# EAGLE design G021old (EAGLE 6.6.0)
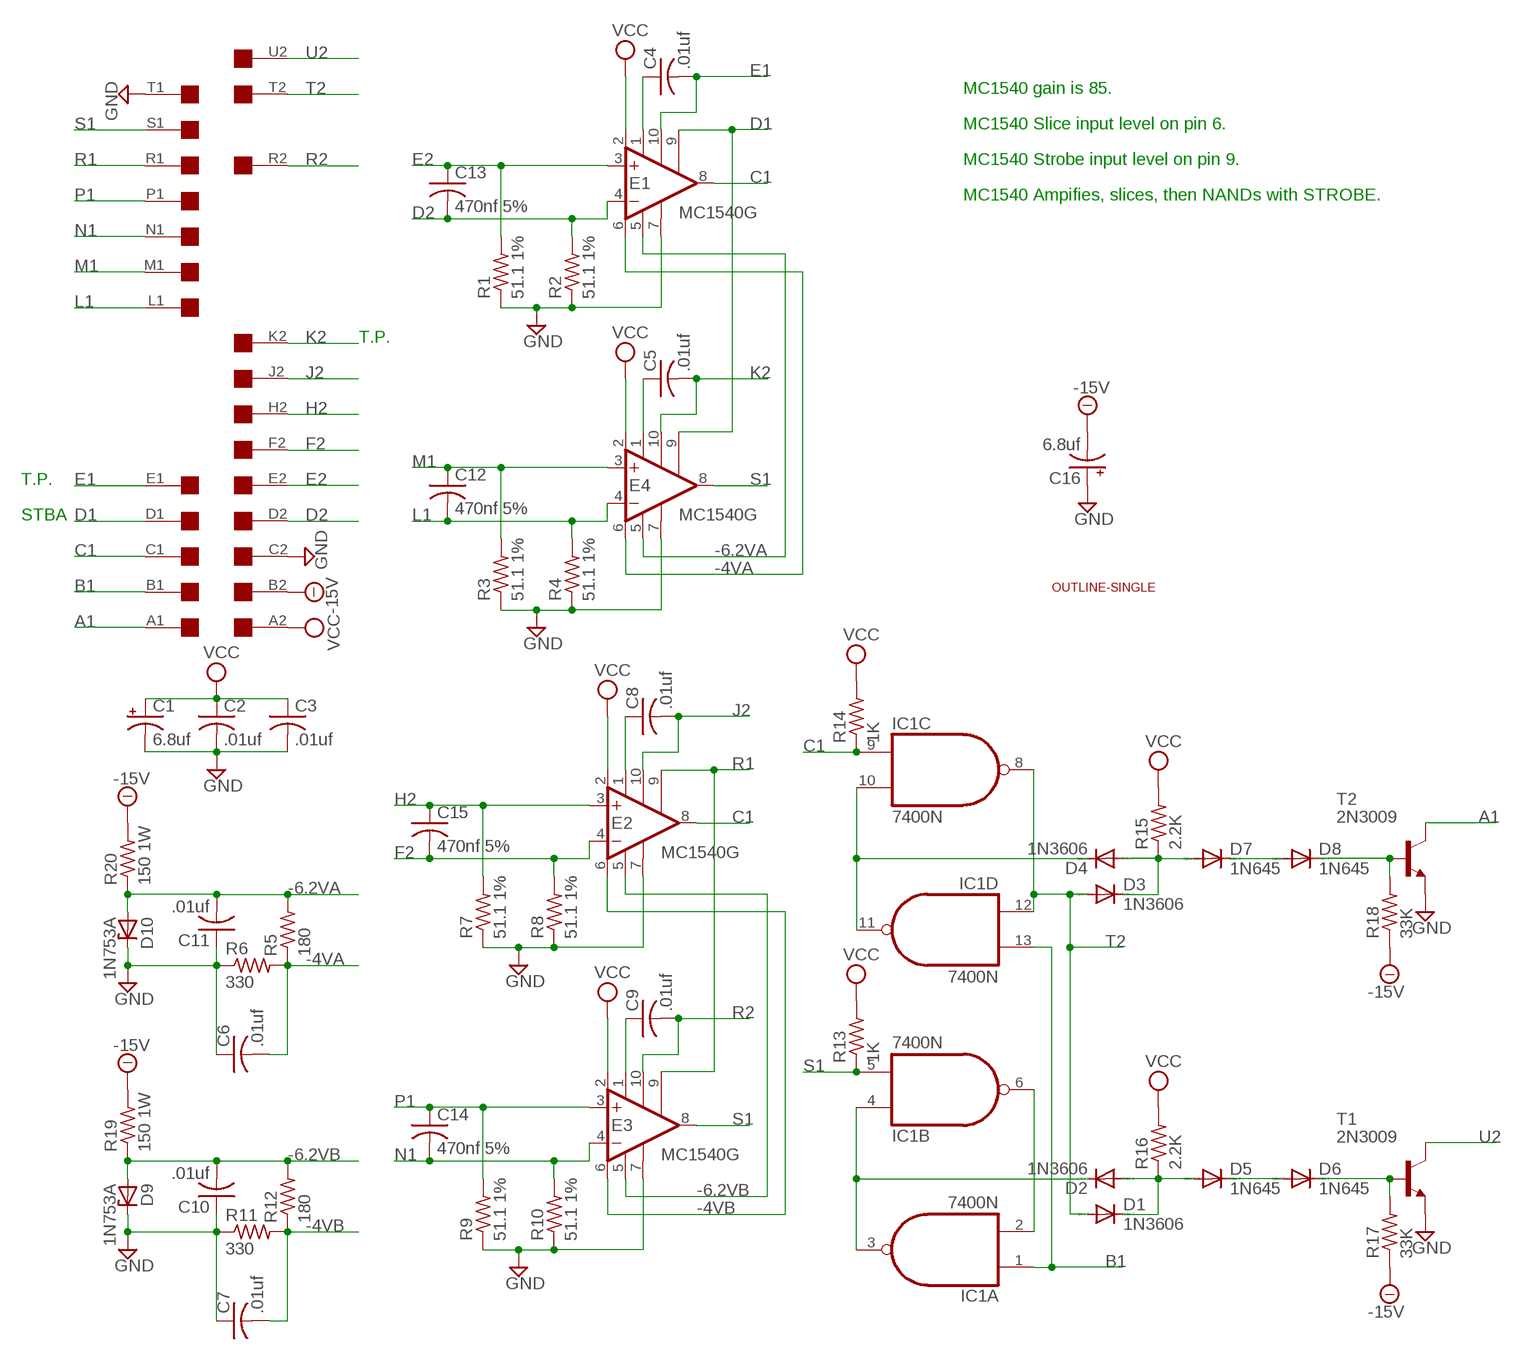
[diagram p0: schematic, sheet 1]

## Parts
C1  6.8uf  CPOL-USE15-5AXIAL  [E15-5]
C2  .01uf  C-US050-025X075  [C050-025X075]
C3  .01uf  C-US050-025X075  [C050-025X075]
C4  .01uf  C-US050-025X075  [C050-025X075]
C5  .01uf  C-US050-025X075  [C050-025X075]
C6  .01uf  C-US050-025X075  [C050-025X075]
C7  .01uf  C-US050-025X075  [C050-025X075]
C8  .01uf  C-US050-025X075  [C050-025X075]
C9  .01uf  C-US050-025X075  [C050-025X075]
C10  .01uf  C-US050-025X075  [C050-025X075]
C11  .01uf  C-US050-025X075  [C050-025X075]
C12  470nf 5%  C-US050-025X075  [C050-025X075]
C13  470nf 5%  C-US050-025X075  [C050-025X075]
C14  470nf 5%  C-US050-025X075  [C050-025X075]
C15  470nf 5%  C-US050-025X075  [C050-025X075]
C16  6.8uf  CPOL-USE15-5AXIAL  [E15-5]
D1  1N3606  1N4148DO35-10  [DO35-10]
D2  1N3606  1N4148DO35-10  [DO35-10]
D3  1N3606  1N4148DO35-10  [DO35-10]
D4  1N3606  1N4148DO35-10  [DO35-10]
D5  1N645  1N4148DO35-10  [DO35-10]
D6  1N645  1N4148DO35-10  [DO35-10]
D7  1N645  1N4148DO35-10  [DO35-10]
D8  1N645  1N4148DO35-10  [DO35-10]
D9  1N753A  ZENER-DIODEF126-10  [F126Z10]
D10  1N753A  ZENER-DIODEF126-10  [F126Z10]
E1  MC1540G  [602B]
E2  MC1540G  [602B]
E3  MC1540G  [602B]
E4  MC1540G  [602B]
IC1  7400N  [DIL14]
R1  51.1 1%  R-US_0207/10  [0207/10]
R2  51.1 1%  R-US_0207/10  [0207/10]
R3  51.1 1%  R-US_0207/10  [0207/10]
R4  51.1 1%  R-US_0207/10  [0207/10]
R5  180  R-US_0207/10  [0207/10]
R6  330  R-US_0207/10  [0207/10]
R7  51.1 1%  R-US_0207/10  [0207/10]
R8  51.1 1%  R-US_0207/10  [0207/10]
R9  51.1 1%  R-US_0207/10  [0207/10]
R10  51.1 1%  R-US_0207/10  [0207/10]
R11  330  R-US_0207/10  [0207/10]
R12  180  R-US_0207/10  [0207/10]
R13  1K  R-US_0207/10  [0207/10]
R14  1K  R-US_0207/10  [0207/10]
R15  2.2K  R-US_0207/10  [0207/10]
R16  2.2K  R-US_0207/10  [0207/10]
R17  33K  R-US_0207/10  [0207/10]
R18  33K  R-US_0207/10  [0207/10]
R19  150 1W  R-US_0414/15  [0414/15]
R20  150 1W  R-US_0414/15  [0414/15]
T1  2N3009  2N3565  [TO92]
T2  2N3009  2N3565  [TO92]
U$1  SINGLE  [EDGE-CON2]
U$2  OUTLINE-SINGLE  [SINGLE]

## Nets
-4VA: C6.2 E1.6(SLICE) E4.6(SLICE) R5.1 R6.2
-4VB: C7.2 E2.6(SLICE) E3.6(SLICE) R11.2 R12.1
-6.2VA: C11.2 D10.A E1.5(V-) E4.5(V-) R5.2 R20.1
-6.2VB: C10.2 D9.A E2.5(V-) E3.5(V-) R12.2 R19.1
-15V: C16.- R17.1 R18.1 R19.2 R20.2 U$1.B2
A1: T2.1(C) U$1.A1
B1: IC1.1(A:I0) IC1.13(D:I1) U$1.B1
C1: E1.8(OUT) E2.8(OUT) IC1.9(C:I0) R14.1 U$1.C1
D1: E1.9(ISTROBE) E4.9(ISTROBE) U$1.D1
D2: C13.2 E1.4(-IN) R2.2 U$1.D2
E1: C4.2 E1.10(CEXTB) U$1.E1
E2: C13.1 E1.3(+IN) R1.2 U$1.E2
F2: C15.2 E2.4(-IN) R8.2 U$1.F2
GND: C1.- C2.2 C3.2 C6.1 C7.1 C10.1 C11.1 C16.+ D9.C D10.C E1.7(GND) E2.7(GND) E3.7(GND) E4.7(GND) R1.1 R2.1 R3.1 R4.1 R6.1 R7.1 R8.1 R9.1 R10.1 R11.1 T1.3(E) T2.3(E) U$1.C2 U$1.T1
H2: C15.1 E2.3(+IN) R7.2 U$1.H2
J2: C8.2 E2.10(CEXTB) U$1.J2
K2: C5.2 E4.10(CEXTB) U$1.K2
L1: C12.2 E4.4(-IN) R4.2 U$1.L1
M1: C12.1 E4.3(+IN) R3.2 U$1.M1
N1: C14.2 E3.4(-IN) R10.2 U$1.N1
N$1: C4.1 E1.1(CEXTA)
N$2: C8.1 E2.1(CEXTA)
N$3: C5.1 E4.1(CEXTA)
N$4: C9.1 E3.1(CEXTA)
N$6: D1.C D2.A D5.A R16.1
N$7: D4.C IC1.10(C:I1) IC1.11(D:O)
N$8: D2.C IC1.3(A:O) IC1.4(B:I0)
N$9: IC1.2(A:I1) IC1.6(B:O)
N$10: D3.C D4.A D7.A R15.1
N$11: D7.C D8.A
N$12: D5.C D6.A
N$13: D8.C R18.2 T2.2(B)
N$14: D6.C R17.2 T1.2(B)
P1: C14.1 E3.3(+IN) R9.2 U$1.P1
R1: E2.9(ISTROBE) E3.9(ISTROBE) U$1.R1
R2: C9.2 E3.10(CEXTB) U$1.R2
S1: E3.8(OUT) E4.8(OUT) IC1.5(B:I1) R13.1 U$1.S1
T2: D1.A D3.A IC1.8(C:O) IC1.12(D:I0) U$1.T2
U2: T1.1(C) U$1.U2
VCC: C1.+ C2.1 C3.1 E1.2(V+) E2.2(V+) E3.2(V+) E4.2(V+) R13.2 R14.2 R15.2 R16.2 U$1.A2
Unconnected: U$1.F1 U$1.H1 U$1.J1 U$1.K1 U$1.L2 U$1.M2 U$1.N2 U$1.P2 U$1.S2 U$1.U1 U$1.V1 U$1.V2

## Notes on the sheet
- MC1540 gain is 85.
- MC1540 Slice input level on pin 6.
- MC1540 Strobe input level on pin 9.
- MC1540 Ampifies, slices, then NANDs with STROBE.
- T.P.
- T.P.
- STBA

## Power pins joined to a net without a drawn wire
GND: IC1.7(P:GND)
VCC: IC1.14(P:VCC)

## Library data of the parts
C1 C16 = rcl:CPOL-US: POLARIZED CAPACITOR, American symbol
C2-C15 = rcl:C-US: CAPACITOR, American symbol
D1-D8 = diode:1N4148: DIODE high speed (Philips)
D9 D10 = diode:ZENER-DIODE: Z-Diode
E1-E4 = dec-con:MC1540: OP AMP
IC1 = 74xx-us:74*00: Quad 2-input NAND gate
R1-R20 = rcl:R-US_: RESISTOR, American symbol
T1 T2 = transistor:2N3565: NPN TRANSISTOR
U$1 = dec-con:SINGLE: Single-Height DEC board
U$2 = dec-con:OUTLINE-*: Board outlines for DEC boards.

## Board
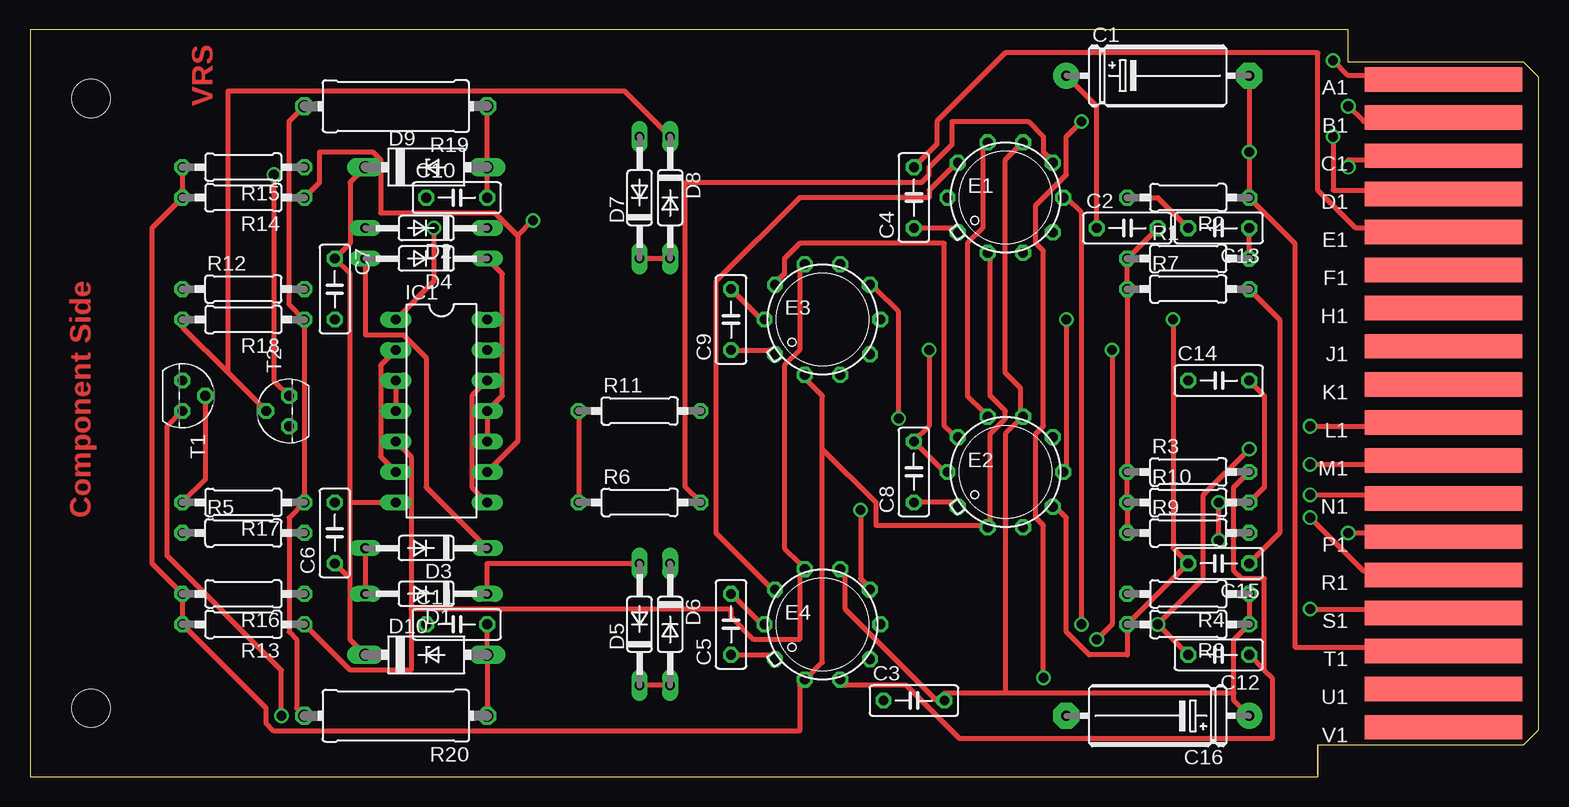
[diagram p1: board, top side]
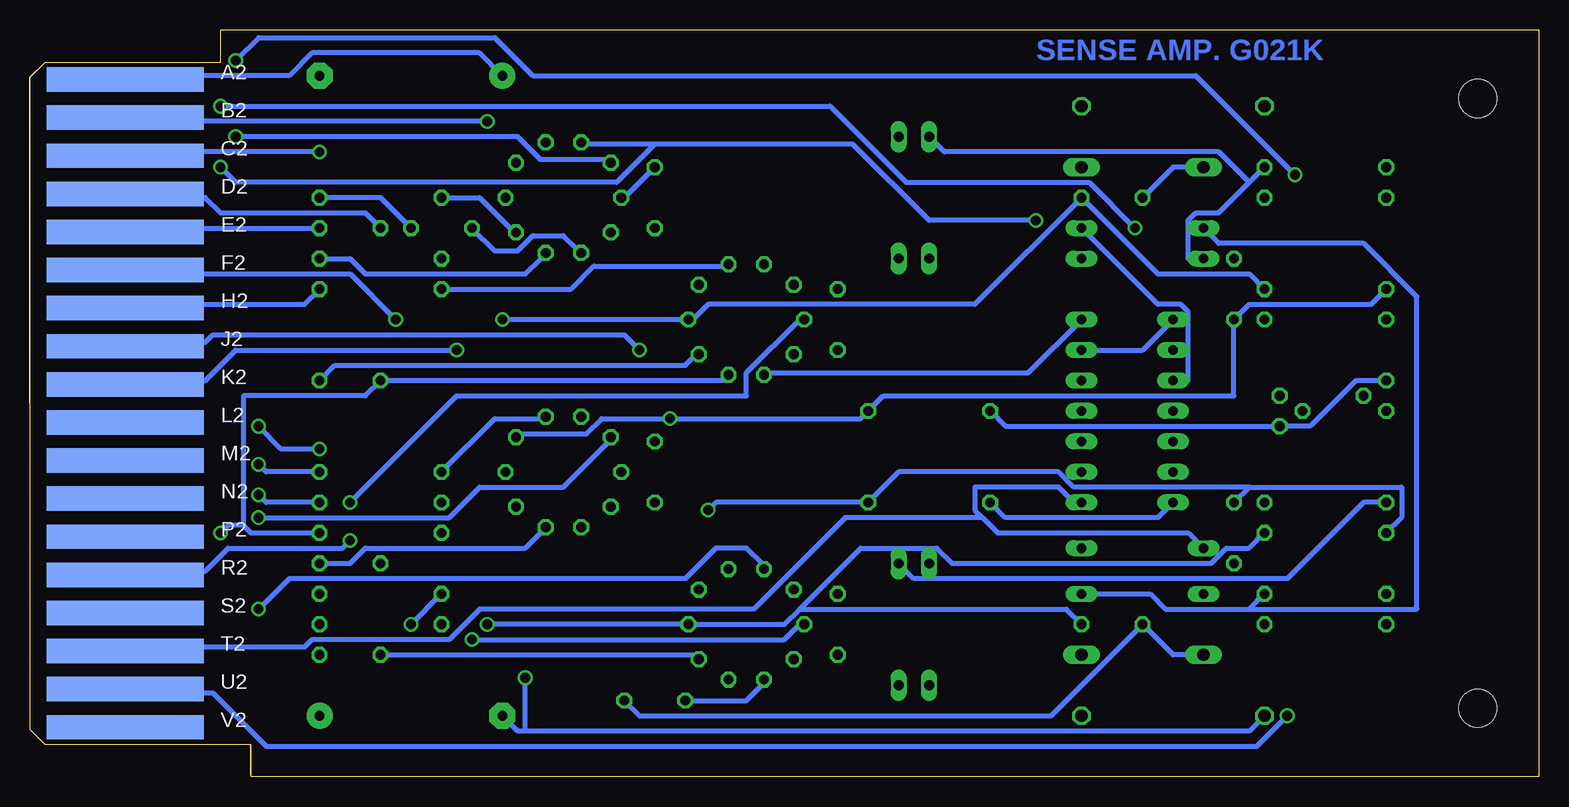
[diagram p2: board, bottom side, seen from below]

Size 125.73 x 62.23 mm. Coordinates in mm from the lower left corner, seen from the top.
Copper layers (1+16): Top 0.035mm / dielectric 1.5mm / Bottom 0.035mm
Design rules "16mils": minimum track width 16mil, minimum drill 32mil, track to track 15mil, track to pad 10mil, pad to pad 10mil, via to via 10mil, smd to smd 10mil, copper to edge 13mil, drill to drill 10mil, minimum pad ring 10mil, minimum via ring 8mil, stop-mask expansion 0mil, vias tented up to drill 0mil, thermal gap 10mil

### Footprints (pad centres in the part's own frame; a part is rotated, then mirrored left to right if it is on the bottom)
E15-5 = drill 0.813 pad 2.159: + -7.62,0 | drill 0.813 pad 2.159 octagon: - 7.62,0
C050-025X075 = drill 0.813 octagon: 1 -2.54,0; 2 2.54,0
DO35-10 = drill 0.813 long: A 5.08,0; C -5.08,0
F126Z10 = drill 1.016 long: A 5.08,0; C -5.08,0
602B = drill 0.813 octagon: 1 -3.954,-2.897; 2 -1.478,-4.605; 3 1.478,-4.605; 4 3.954,-2.897; 5 4.825,0; 6 3.954,2.897; 7 1.478,4.605; 8 -1.477,4.605; 9 -3.954,2.897; 10 -4.825,0
DIL14 = drill 0.813 long: 1 -7.62,-3.81; 2 -5.08,-3.81; 3 -2.54,-3.81; 4 0,-3.81; 5 2.54,-3.81; 6 5.08,-3.81; 7 7.62,-3.81; 8 7.62,3.81; 9 5.08,3.81; 10 2.54,3.81; 11 0,3.81; 12 -2.54,3.81; 13 -5.08,3.81; 14 -7.62,3.81
0207/10 = drill 0.813 octagon: 1 -5.08,0; 2 5.08,0
0414/15 = drill 1.016 octagon: 1 -7.62,0; 2 7.62,0
TO92 = drill 0.813 octagon: 1 1.27,0; 2 0,1.905; 3 -1.27,0
EDGE-CON2 = smd 13.106 x 2.032: A1 7.938,4.128; B1 7.938,7.303; C1 7.938,10.477; D1 7.938,13.652; E1 7.938,16.828; F1 7.938,20.003; H1 7.938,23.177; J1 7.938,26.352; K1 7.938,29.527; L1 7.938,32.703; M1 7.938,35.877; N1 7.938,39.053; P1 7.938,42.227; R1 7.938,45.403; S1 7.938,48.578; T1 7.938,51.752; U1 7.938,54.928; V1 7.938,58.102 | smd 13.106 x 2.032 bottom: A2 7.938,4.128; B2 7.938,7.303; C2 7.938,10.477; D2 7.938,13.652; E2 7.938,16.828; F2 7.938,20.003; H2 7.938,23.177; J2 7.938,26.352; K2 7.938,29.527; L2 7.938,32.703; M2 7.938,35.877; N2 7.938,39.053; P2 7.938,42.227; R2 7.938,45.403; S2 7.938,48.578; T2 7.938,51.752; U2 7.938,54.928; V2 7.938,58.102
SINGLE = hole 3.175: 120.65,56.515; 120.65,5.715

### Placement (x,y rotation side)
C1  93.98,58.42 0 top
C2  91.44,45.72 0 top
C3  73.66,6.35 0 top
C4  73.66,48.26 90 top
C5  58.42,12.7 90 top
C6  25.4,20.32 90 top
C7  25.4,40.64 270 top
C8  73.66,25.4 90 top
C9  58.42,38.1 90 top
C10  35.56,48.26 0 top
C11  35.56,12.7 0 top
C12  99.06,10.16 180 top
C13  99.06,45.72 180 top
C14  99.06,33.02 0 top
C15  99.06,17.78 180 top
C16  93.98,5.08 180 top
D1  33.02,15.24 180 top
D2  33.02,45.72 180 top
D3  33.02,19.05 180 top
D4  33.02,43.18 180 top
D5  50.8,12.7 90 top
D6  53.34,12.7 270 top
D7  50.8,48.26 90 top
D8  53.34,48.26 270 top
D9  33.02,50.8 0 top
D10  33.02,10.16 0 top
E1  81.28,48.26 0 top
E2  81.28,25.4 0 top
E3  66.04,38.1 0 top
E4  66.04,12.7 0 top
IC1  34.29,30.48 270 top
R1  96.52,43.18 0 top
R2  96.52,48.26 180 top
R3  96.52,25.4 0 top
R4  96.52,15.24 180 top
R5  17.78,20.32 0 top
R6  50.8,22.86 0 top
R7  96.52,40.64 0 top
R8  96.52,12.7 180 top
R9  96.52,20.32 0 top
R10  96.52,22.86 0 top
R11  50.8,30.48 0 top
R12  17.78,40.64 0 top
R13  17.78,12.7 180 top
R14  17.78,48.26 180 top
R15  17.78,50.8 180 top
R16  17.78,15.24 180 top
R17  17.78,22.86 180 top
R18  17.78,38.1 180 top
R19  30.48,55.88 180 top
R20  30.48,5.08 180 top
T1  12.7,31.75 270 top
T2  21.59,30.48 90 top
U$1  125.73,62.23 180 top
U$2  125.73,62.23 180 top

### Tracks (layer width: path | path; a pad name or v marks a point on that pad's centre or on a via)
-4VA  (via drill 0.81)
  Top 0.406: v69.22,22.23 69.22,16.51 69.85,15.88 E4.6 | R6.2 54.61,24.13 54.61,49.53 74.3,49.53 74.93,50.16 74.93,50.8 76.83,52.7 76.83,54.61 83.19,54.61 84.45,53.34 84.45,52.07 85.09,51.44 E1.6
  Bottom 0.406: R5.1 11.43,21.59 11.43,24.13 24.13,24.13 | C6.2 24.13,24.13 | 24.13,24.13 38.73,24.13 40.01,25.4 53.34,25.4 R6.2 68.58,22.86 v69.22,22.23
-4VB  (via drill 0.81)
  Top 0.406: v72.39,29.84 72.39,38.73 70.48,40.64 E3.6
  Bottom 0.406: R12.1 13.97,39.37 24.13,39.37 C7.2 25.4,31.75 54.61,31.75 R11.2 56.52,29.84 v72.39,29.84 78.11,29.84 79.38,28.57 85.09,28.57 E2.6
-6.2VA  (via drill 0.81)
  Top 0.406: C11.2 D10.A R20.1 | v87.63,12.7 87.63,46.99 86.36,48.26 E1.5
  Bottom 0.406: R5.2 24.13,19.05 26.04,19.05 27.3,17.78 48.9,17.78 50.16,19.05 56.52,19.05 61.59,13.97 | 61.59,13.97 62.87,12.7 E4.5 v87.63,12.7 | C11.2 39.37,13.97 61.59,13.97
-6.2VB  (via drill 0.81)
  Top 0.406: v86.36,38.1 86.36,25.4 E2.5 | C10.2 D9.A R19.1
  Bottom 0.406: R12.2 24.13,41.91 31.75,41.91 C10.2 46.99,39.37 69.22,39.37 70.48,38.1 E3.5 v86.36,38.1
-15V  (via drill 0.81)
  Top 0.406: R20.2 22.23,5.71 22.23,11.43 21.59,12.06 21.59,21.59 R17.1 R18.1 21.59,39.37 21.59,54.61 R19.2 | v87.63,54.61 86.36,53.34 86.36,50.16 83.82,47.62 83.82,44.45 84.45,43.81 84.45,29.21 83.82,28.57 83.82,21.59 84.45,20.95 v84.45,8.26
  Bottom 0.406: C16.- 85.09,3.81 84.45,3.81 | 84.45,3.81 24.13,3.81 R20.2 | v87.63,54.61 117.47,54.61 U$1.B2 | 84.45,3.81 v84.45,8.26
A1  (via drill 0.81)
  Top 0.406: T2.1 20.32,33.02 v20.32,50.16 | v108.58,59.69 109.86,58.42 117.47,58.42 U$1.A1
  Bottom 0.406: v20.32,50.16 28.57,58.42 83.82,58.42 87,61.59 106.68,61.59 v108.58,59.69
B1  (via drill 0.81)
  Top 0.406: IC1.1 33.66,41.27 v33.66,45.72 | v109.86,55.88 111.12,54.61 117.47,54.61 U$1.B1
  Bottom 0.406: IC1.1 33.02,35.56 IC1.13 | v33.66,45.72 37.47,49.53 52.7,49.53 59.05,55.88 v109.86,55.88
C1  (via drill 0.81)
  Top 0.406: E2.8 79.38,30.48 78.11,31.75 78.11,44.45 79.38,45.72 79.38,52.7 E1.8 | IC1.9 40.64,27.94 40.64,45.09 | 40.64,45.09 38.73,46.99 29.21,46.99 29.21,51.44 28.57,52.07 24.13,52.07 24.13,49.53 R14.1 | 40.64,45.09 v41.91,46.35 | v109.86,50.8 109.86,51.44 117.47,51.44 U$1.C1
  Bottom 0.406: 73.66,52.7 57.15,52.7 50.8,46.35 v41.91,46.35 | 73.66,52.7 79.38,52.7 E1.8 | v109.86,50.8 108.58,49.53 76.83,49.53 73.66,52.7
D1  (via drill 0.81)
  Top 0.406: E4.9 61.59,15.88 57.15,20.32 57.15,41.27 64.14,48.26 74.93,48.26 74.93,48.9 76.83,50.8 E1.9 | v108.58,53.34 108.58,48.9 117.47,48.9 U$1.D1
  Bottom 0.406: v108.58,53.34 85.09,53.34 83.19,51.44 77.47,51.44 E1.9
D2
  Top 0.406: C13.2 93.98,48.26 R2.2
  Bottom 0.406: R2.2 88.27,48.26 85.72,45.72 E1.4 | C13.2 97.79,46.99 109.86,46.99 111.12,48.26 117.47,48.26 U$1.D2
E1
  Top 0.406: C4.2 75.56,52.7 75.56,54.61 81.28,60.33 107.31,60.33 107.31,48.9 110.49,45.72 117.47,45.72 U$1.E1
  Bottom 0.406: C4.2 76.2,48.26 E1.10
E2
  Top 0.406: R1.2 C13.1
  Bottom 0.406: R1.2 99.06,43.18 97.79,41.91 84.45,41.91 83.19,43.18 E1.3 | C13.1 117.47,45.72 U$1.E2
F2  (via drill 0.81)
  Top 0.406: E2.4 85.72,22.23 86.36,21.59 86.36,12.06 88.27,10.16 91.44,10.16 R8.2 C15.2 95.25,19.05 v95.25,38.1
  Bottom 0.406: v95.25,38.1 99.06,41.91 117.47,41.91 U$1.F2
GND  (via drill 0.81)
  Top 0.406: D9.C 26.67,49.53 26.67,44.45 C7.1 26.67,41.91 26.67,22.86 | R11.1 R6.1 | 26.67,16.51 C6.1 | 26.67,16.51 26.67,11.43 D10.C | 26.67,22.86 IC1.7 | 26.67,16.51 26.67,22.86 | R4.1 R8.1 100.33,11.43 100.33,6.99 | 100.33,6.99 100.33,6.35 C16.+ | E4.7 67.94,17.14 67.94,13.97 75.56,6.35 C3.2 76.2,6.99 81.28,6.99 | 81.28,6.99 100.33,6.99 | R9.1 R10.1 R3.1 R7.1 R1.1 C2.2 | E1.7 82.55,52.7 81.28,51.44 81.28,33.66 82.55,32.38 82.55,30.48 E2.7 82.55,29.84 81.28,28.57 81.28,6.99 | C1.- v101.6,52.07 R2.1 105.41,44.45 105.41,10.79 117.47,10.79 U$1.T1
  Bottom 0.406: C10.1 30.48,50.8 D9.C | T1.3 15.24,33.02 19.05,29.21 T2.3 44.45,29.21 R11.1 | D10.C 30.48,10.16 C11.1 40.64,5.08 74.93,5.08 C3.2 | R6.1 44.45,21.59 31.75,21.59 IC1.7 | R3.1 87,29.84 83.19,29.84 E2.7 | R7.1 80.64,40.64 78.74,42.55 67.94,42.55 E3.7 | R2.1 96.52,48.26 C2.2 | v101.6,52.07 117.47,52.07 U$1.C2
H2
  Top 0.406: C15.1 104.14,20.32 104.14,38.1 R7.2
  Bottom 0.406: C15.1 99.06,17.78 97.79,19.05 84.45,19.05 83.19,20.32 E2.3 | R7.2 102.87,39.37 117.47,39.37 U$1.H2
J2  (via drill 0.81)
  Top 0.406: E2.10 76.2,25.4 C8.2 74.93,29.21 v74.93,35.56
  Bottom 0.406: v74.93,35.56 76.2,36.83 110.49,36.83 111.12,36.2 117.47,36.2 U$1.J2
K2  (via drill 0.81)
  Top 0.406: C5.2 60.96,12.7 E4.10 | v88.9,11.43 90.17,12.7 v90.17,35.56
  Bottom 0.406: v88.9,11.43 62.87,11.43 61.59,12.7 E4.10 | v90.17,35.56 108.58,35.56 111.12,33.02 117.47,33.02 U$1.K2
L1  (via drill 0.81)
  Top 0.406: C12.2 v93.98,12.7 97.79,16.51 97.79,23.5 v101.6,27.3 | v106.68,29.21 117.47,29.21 U$1.L1
  Bottom 0.406: C12.2 70.48,10.16 E4.4 | v93.98,12.7 R4.2 | v106.68,29.21 104.78,27.3 v101.6,27.3
M1  (via drill 0.81)
  Top 0.406: C12.1 102.87,8.89 | 102.87,8.89 103.5,8.26 103.5,3.17 77.47,3.17 73.03,7.62 67.94,7.62 E4.3 | R3.2 100.33,24.13 100.33,17.14 100.97,16.51 102.87,16.51 102.87,8.89 | v106.68,26.04 117.47,26.04 U$1.M1
  Bottom 0.406: v106.68,26.04 106.05,25.4 R3.2
N1  (via drill 0.81)
  Top 0.406: R10.2 102.87,24.13 102.87,31.75 C14.2 | v106.68,23.5 117.47,23.5 U$1.N1
  Bottom 0.406: C14.2 100.33,34.29 71.12,34.29 70.48,34.92 E3.4 | v106.68,23.5 106.05,22.86 R10.2
N$1
  Top 0.406: C4.1 76.83,45.72 E1.1
N$2
  Top 0.406: C8.1 76.83,22.86 E2.1
N$3
  Top 0.406: C5.1 61.59,10.16 E4.1
N$4
  Top 0.406: C9.1 61.59,35.56 E3.1
N$6
  Top 0.406: D5.A 38.1,17.78 D1.C
  Bottom 0.406: 24.13,13.97 R16.1 | 24.13,13.97 31.11,13.97 32.38,15.24 D1.C | D2.A 26.67,44.45 14.61,44.45 10.16,40.01 10.16,13.97 24.13,13.97
N$7
  Top 0.406: IC1.10 IC1.11 39.37,31.75 39.37,41.91 D4.C
N$8
  Top 0.406: IC1.3 IC1.4
  Bottom 0.406: D2.C 31.75,39.37 29.84,39.37 29.21,38.73 29.21,33.02 IC1.3
N$9
  Top 0.406: IC1.6 29.21,26.67 29.21,34.29 IC1.2
N$10
  Top 0.406: D3.C 33.02,24.13 33.02,34.92 31.11,36.83 27.94,36.83 D4.A
  Bottom 0.406: 24.13,49.53 26.67,46.99 28.57,46.99 29.21,46.35 29.21,43.18 D4.A | 24.13,49.53 R15.1 | D7.A 49.53,52.07 26.67,52.07 24.13,49.53
N$11
  Top 0.406: D8.A D7.C
N$12
  Top 0.406: D6.A D5.C
N$13
  Top 0.406: 16.51,33.66 12.7,37.47 R18.2 | 16.51,33.66 T2.2 | D8.C 49.53,57.15 16.51,57.15 16.51,33.66
N$14
  Top 0.406: R17.2 14.61,24.77 T1.2
  Bottom 0.406: D6.C 52.07,16.51 20.95,16.51 14.61,22.86 R17.2
P1  (via drill 0.81)
  Top 0.406: v109.86,20.32 117.47,20.32 U$1.P1
  Bottom 0.406: E3.3 67.94,33.02 C14.1 97.79,31.75 107.95,31.75 107.95,20.95 | R9.2 107.31,20.32 107.95,20.95 | v109.86,20.32 109.22,20.95 107.95,20.95
R1  (via drill 0.81)
  Top 0.406: E3.9 62.23,41.27 62.87,41.91 62.87,43.18 64.14,44.45 76.2,44.45 76.2,29.21 76.83,28.57 E2.9 | v106.68,21.59 111.12,17.14 117.47,17.14 U$1.R1
  Bottom 0.406: v106.68,21.59 90.81,21.59 88.27,24.13 81.28,24.13 77.47,27.94 E2.9
R2  (via drill 0.81)
  Top 0.406: C9.2 60.96,38.1 E3.10 | v99.06,19.68 v99.06,22.86
  Bottom 0.406: v99.06,22.86 90.17,31.75 66.04,31.75 66.04,33.66 61.59,38.1 E3.10 | v99.06,19.68 99.69,19.05 109.22,19.05 111.12,17.14 117.47,17.14 U$1.R2
S1  (via drill 0.81)
  Top 0.406: R13.1 26.67,8.89 31.75,8.89 31.75,13.97 | 31.75,13.97 31.75,26.67 IC1.5 | E3.8 64.14,42.55 64.14,35.56 62.87,34.29 62.87,19.05 64.14,17.78 E4.8 64.14,17.14 64.14,11.43 60.33,11.43 58.42,13.34 58.42,13.97 31.75,13.97 | v106.68,13.97 117.47,13.97 U$1.S1
  Bottom 0.406: v106.68,13.97 104.14,16.51 71.12,16.51 68.58,19.05 66.04,19.05 64.77,17.78 E4.8
T2
  Top 0.406: D3.A D1.A | IC1.8 36.83,24.13 36.83,31.75 IC1.12
  Bottom 0.406: D3.A 29.21,20.32 45.09,20.32 46.35,21.59 | 46.35,21.59 46.99,22.23 46.99,24.13 40.01,24.13 38.73,22.86 IC1.8 | 46.35,21.59 57.78,21.59 65.41,13.97 88.27,13.97 90.81,11.43 102.23,11.43 102.87,10.79 117.47,10.79 U$1.T2
U2  (via drill 0.81)
  Top 0.406: T1.1 11.43,29.21 11.43,18.41 20.95,8.89 v20.95,5.08
  Bottom 0.406: v20.95,5.08 23.5,2.54 106.05,2.54 110.49,6.99 117.47,6.99 U$1.U2
VCC
  Top 0.406: R15.2 R14.2 10.16,45.72 10.16,17.78 R16.2 R13.2 19.68,5.71 19.68,4.45 20.32,3.81 64.14,3.81 64.14,7.62 E4.2 64.77,8.26 66.04,9.53 66.04,27.3 | C1.+ 88.9,55.88 C2.1 | 66.04,27.3 66.04,31.75 64.77,33.02 E3.2 | 66.04,27.3 70.48,22.86 70.48,20.95 79.38,20.95 E2.2 80.01,20.95 80.01,28.57 81.28,29.84 81.28,30.48 80.01,31.75 80.01,43.18 E1.2
  Bottom 0.406: C2.1 87,43.81 85.09,43.81 83.82,45.09 81.28,45.09 80.01,43.81 E1.2 | C3.1 66.04,6.35 64.77,7.62 E4.2 | IC1.14 42.55,33.66 64.14,33.66 E3.2 | C1.+ 88.27,60.33 102.23,60.33 104.14,58.42 117.47,58.42 U$1.A2

### Text on the board
Top: VRS | Component Side
Bottom: SENSE AMP. G021K